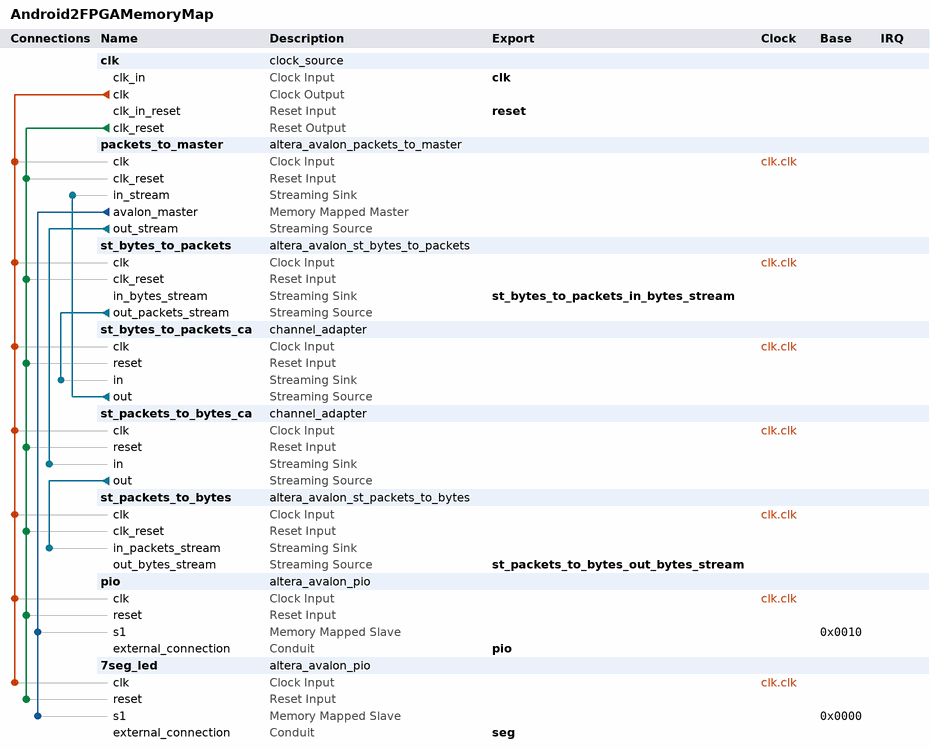
[diagram p0: system contents]
# Platform Designer (Qsys) system Android2FPGAMemoryMap, Cyclone IV E EP4CE22F17C6
# Parameters at their usual value, and those the tool derives, are not listed.
package require -exact qsys 12.1
create_system Android2FPGAMemoryMap
set_project_property DEVICE_FAMILY {Cyclone IV E}
set_project_property DEVICE EP4CE22F17C6

add_instance clk clock_source 12.1
set_instance_parameter_value clk clockFrequency 50000000

add_instance packets_to_master altera_avalon_packets_to_master 12.1
set_instance_parameter_value packets_to_master EXPORT_MASTER_SIGNALS 0
set_instance_parameter_value packets_to_master FAST_VER 0
set_instance_parameter_value packets_to_master FIFO_DEPTHS 2

add_instance st_bytes_to_packets altera_avalon_st_bytes_to_packets 11.1
set_instance_parameter_value st_bytes_to_packets CHANNEL_WIDTH 8
set_instance_parameter_value st_bytes_to_packets ENCODING 0

add_instance st_bytes_to_packets_ca channel_adapter 12.1
set_instance_parameter_value st_bytes_to_packets_ca generationLanguage VERILOG
set_instance_parameter_value st_bytes_to_packets_ca inBitsPerSymbol 8
set_instance_parameter_value st_bytes_to_packets_ca inChannelWidth 8
set_instance_parameter_value st_bytes_to_packets_ca inErrorWidth 0
set_instance_parameter_value st_bytes_to_packets_ca inMaxChannel 255
set_instance_parameter_value st_bytes_to_packets_ca inReadyLatency 0
set_instance_parameter_value st_bytes_to_packets_ca inSymbolsPerBeat 1
set_instance_parameter_value st_bytes_to_packets_ca inUseEmpty false
set_instance_parameter_value st_bytes_to_packets_ca inUseEmptyPort NO
set_instance_parameter_value st_bytes_to_packets_ca inUsePackets true
set_instance_parameter_value st_bytes_to_packets_ca inUseReady true
set_instance_parameter_value st_bytes_to_packets_ca outChannelWidth 0
set_instance_parameter_value st_bytes_to_packets_ca outMaxChannel 0

add_instance st_packets_to_bytes_ca channel_adapter 12.1
set_instance_parameter_value st_packets_to_bytes_ca generationLanguage VERILOG
set_instance_parameter_value st_packets_to_bytes_ca inBitsPerSymbol 8
set_instance_parameter_value st_packets_to_bytes_ca inChannelWidth 0
set_instance_parameter_value st_packets_to_bytes_ca inErrorWidth 0
set_instance_parameter_value st_packets_to_bytes_ca inMaxChannel 0
set_instance_parameter_value st_packets_to_bytes_ca inReadyLatency 0
set_instance_parameter_value st_packets_to_bytes_ca inSymbolsPerBeat 1
set_instance_parameter_value st_packets_to_bytes_ca inUseEmpty false
set_instance_parameter_value st_packets_to_bytes_ca inUseEmptyPort NO
set_instance_parameter_value st_packets_to_bytes_ca inUsePackets true
set_instance_parameter_value st_packets_to_bytes_ca inUseReady true
set_instance_parameter_value st_packets_to_bytes_ca outChannelWidth 8
set_instance_parameter_value st_packets_to_bytes_ca outMaxChannel 255

add_instance st_packets_to_bytes altera_avalon_st_packets_to_bytes 11.1
set_instance_parameter_value st_packets_to_bytes CHANNEL_WIDTH 8
set_instance_parameter_value st_packets_to_bytes ENCODING 0

add_instance pio altera_avalon_pio 12.1
set_instance_parameter_value pio direction Output
set_instance_parameter_value pio width 8

add_instance 7seg_led altera_avalon_pio 12.1
set_instance_parameter_value 7seg_led direction Output
set_instance_parameter_value 7seg_led width 8

# connections
add_connection clk.clk 7seg_led.clk clock
add_connection clk.clk packets_to_master.clk clock
add_connection clk.clk pio.clk clock
add_connection clk.clk st_bytes_to_packets.clk clock
add_connection clk.clk st_bytes_to_packets_ca.clk clock
add_connection clk.clk st_packets_to_bytes.clk clock
add_connection clk.clk st_packets_to_bytes_ca.clk clock
add_connection clk.clk_reset 7seg_led.reset reset
add_connection clk.clk_reset packets_to_master.clk_reset reset
add_connection clk.clk_reset pio.reset reset
add_connection clk.clk_reset st_bytes_to_packets.clk_reset reset
add_connection clk.clk_reset st_bytes_to_packets_ca.reset reset
add_connection clk.clk_reset st_packets_to_bytes.clk_reset reset
add_connection clk.clk_reset st_packets_to_bytes_ca.reset reset
add_connection packets_to_master.avalon_master 7seg_led.s1 avalon
set_connection_parameter_value packets_to_master.avalon_master/7seg_led.s1 baseAddress 0x0000
add_connection packets_to_master.avalon_master pio.s1 avalon
set_connection_parameter_value packets_to_master.avalon_master/pio.s1 baseAddress 0x0010
add_connection packets_to_master.out_stream st_packets_to_bytes_ca.in avalon_streaming
add_connection st_bytes_to_packets.out_packets_stream st_bytes_to_packets_ca.in avalon_streaming
add_connection st_bytes_to_packets_ca.out packets_to_master.in_stream avalon_streaming
add_connection st_packets_to_bytes_ca.out st_packets_to_bytes.in_packets_stream avalon_streaming

# exported interfaces
add_interface clk clock sink
set_interface_property clk EXPORT_OF clk.clk_in
add_interface reset reset sink
set_interface_property reset EXPORT_OF clk.clk_in_reset
add_interface st_bytes_to_packets_in_bytes_stream avalon_streaming sink
set_interface_property st_bytes_to_packets_in_bytes_stream EXPORT_OF st_bytes_to_packets.in_bytes_stream
add_interface st_packets_to_bytes_out_bytes_stream avalon_streaming source
set_interface_property st_packets_to_bytes_out_bytes_stream EXPORT_OF st_packets_to_bytes.out_bytes_stream
add_interface pio conduit end
set_interface_property pio EXPORT_OF pio.external_connection
add_interface seg conduit end
set_interface_property seg EXPORT_OF 7seg_led.external_connection

save_system Android2FPGAMemoryMap.qsys
